# Altium schematic sheet microcontroller.SchDoc: microcontroller
size A4; Date: 05.10.2017; CheckedBy: UNCHECKED; Author: Leon Loeser; Organization: Baltic Racing; Address1: Zur Schwedenschanze 15; Address2: Haus 18; Address3: 18435 Stralsund; Revision: xx.xx; SheetNumber: 8; SheetTotal: 9; Rules: TODO; ProjectName: Projekt
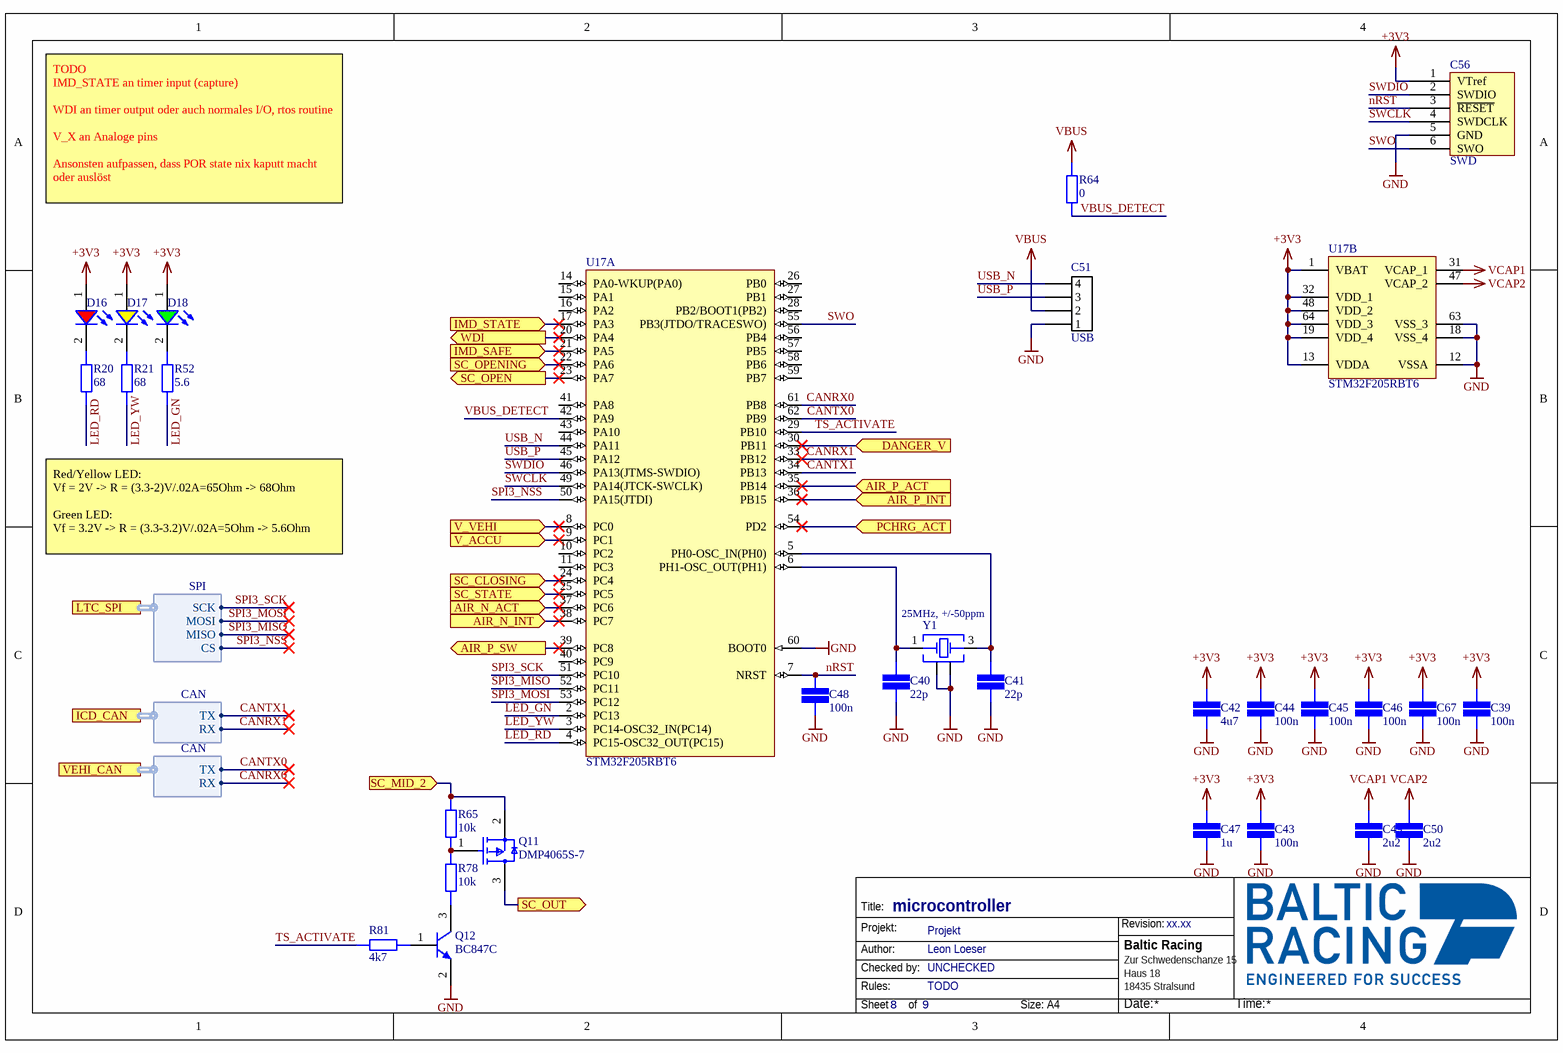
[diagram p0: microcontroller.SchDoc]

## Parts
C39  value 100n  [CAP 0603/1608]  (hidden comment: SMD Capacitor)
C40  value 22p  [CAP 0603/1608]  (hidden comment: SMD Capacitor)
C41  value 22p  [CAP 0603/1608]  (hidden comment: SMD Capacitor)
C42  value 4u7  [CAP 0805/2012]  (hidden comment: SMD Capacitor)
C43  value 100n  [CAP 0603/1608]  (hidden comment: SMD Capacitor)
C44  value 100n  [CAP 0603/1608]  (hidden comment: SMD Capacitor)
C45  value 100n  [CAP 0603/1608]  (hidden comment: SMD Capacitor)
C46  value 100n  [CAP 0603/1608]  (hidden comment: SMD Capacitor)
C47  value 1u  [CAP 0805/2012]  (hidden comment: SMD Capacitor)
C48  value 100n  [CAP 0603/1608]  (hidden comment: SMD Capacitor)
C49  value 2u2  [CAP 0805/2012]  (hidden comment: SMD Capacitor)
C50  value 2u2  [CAP 0805/2012]  (hidden comment: SMD Capacitor)
C51  USB  [43045-0412]
C56  SWD  [SEGGER_6_PIN]  (no BOM)
C67  value 100n  [CAP 0603/1608]  (hidden comment: SMD Capacitor)
D16  Red, 2 V, 140 deg  [WL-SMCW_0603_H=0.25]  (value not drawn)
D17  Yellow, 2 V, 140 deg  [WL-SMCW_0603_H=0.25]  (value not drawn)
D18  Green, 3.2 V, 140 deg  [WL-SMCW_0603_H=0.25]  (value not drawn)
Q11  DMP4065S-7  [FP-SOT23-MFG]
Q12  BC847C  [INF-SOT23_L]
R20  value 68  [STACKPOLE CSR0603]  (hidden comment: SMD Resistor)
R21  value 68  [STACKPOLE CSR0603]  (hidden comment: SMD Resistor)
R52  value 5.6  [STACKPOLE CSR0603]  (hidden comment: SMD Resistor)
R64  value 0  [STACKPOLE CSR0603]  (hidden comment: SMD Resistor)
R65  value 10k  [STACKPOLE CSR0603]  (hidden comment: SMD Resistor)
R78  value 10k  [STACKPOLE CSR0603]  (hidden comment: SMD Resistor)
R81  value 4k7  [STACKPOLE CSR0603]  (hidden comment: SMD Resistor)
U17  STM32F205RBT6  [STM-LQFP64_L]  (parts A,B of 2)
Y1  25MHz, +/-50ppm  [WE-XTAL_CFPX-180]

## Ports
AIR_N_ACT (in), AIR_N_INT (in), AIR_P_ACT (in), AIR_P_INT (in), AIR_P_SW (out), DANGER_V (in), ICD_CAN (harness CAN), IMD_SAFE (in), IMD_STATE (in), LTC_SPI (harness SPI), PCHRG_ACT (in), SC_CLOSING (in), SC_MID_2 (in), SC_OPEN (out), SC_OPENING (in), SC_OUT (out), SC_STATE (in), V_ACCU (in), V_VEHI (in), VEHI_CAN (harness CAN), WDI (out)

## Harnesses
CAN: TX, RX
SPI: SCK, MOSI, MISO, CS

## Nets
+3V3: C39.2 C42.2 C43.2 C44.2 C45.2 C46.2 C47.2 C56.1(VTref) C67.2 D16.1(A) D17.1(A) D18.1(A) U17.1(VBAT) U17.13(VDDA) U17.19(VDD_4) U17.32(VDD_1) U17.48(VDD_2) U17.64(VDD_3)
GND: C39.1 C40.1 C41.1 C42.1 C43.1 C44.1 C45.1 C46.1 C47.1 C48.1 C49.1 C50.1 C51.1 C56.5(GND) C67.1 Q12.2(E) U17.12(VSSA) U17.18(VSS_4) U17.60(BOOT0) U17.63(VSS_3) Y1.2(GND) Y1.4(GND)
VBUS: C51.2 R64.2
VCAP1: C49.2 U17.31(VCAP_1)
VCAP2: C50.2 U17.47(VCAP_2)
AIR_N_ACT: U17.37(PC6) ; port AIR_N_ACT
AIR_N_INT: U17.38(PC7) ; port AIR_N_INT
AIR_P_ACT: U17.35(PB14) ; port AIR_P_ACT
AIR_P_INT: U17.36(PB15) ; port AIR_P_INT
AIR_P_SW: U17.39(PC8) ; port AIR_P_SW
CANRX0: U17.61(PB8) ; port VEHI_CAN.RX
CANRX1: U17.33(PB12) ; port ICD_CAN.RX
CANTX0: U17.62(PB9) ; port VEHI_CAN.TX
CANTX1: U17.34(PB13) ; port ICD_CAN.TX
DANGER_V: U17.30(PB11) ; port DANGER_V
IMD_SAFE: U17.21(PA5) ; port IMD_SAFE
IMD_STATE: U17.17(PA3) ; port IMD_STATE
LED_GN: R52.1 U17.2(PC13)
LED_RD: R20.1 U17.4(PC15-OSC32_OUT(PC15))
LED_YW: R21.1 U17.3(PC14-OSC32_IN(PC14))
nRST: C48.2 C56.3(~{RESET}) U17.7(NRST)
PCHRG_ACT: U17.54(PD2) ; port PCHRG_ACT
SC_CLOSING: U17.24(PC4) ; port SC_CLOSING
SC_MID_2: Q11.2(S) R65.1 ; port SC_MID_2
SC_OPEN: U17.23(PA7) ; port SC_OPEN
SC_OPENING: U17.22(PA6) ; port SC_OPENING
SC_OUT: Q11.3(D) ; port SC_OUT
SC_STATE: U17.25(PC5) ; port SC_STATE
SPI3_MISO: U17.52(PC11) ; port LTC_SPI.MISO
SPI3_MOSI: U17.53(PC12) ; port LTC_SPI.MOSI
SPI3_NSS: U17.50(PA15(JTDI)) ; port LTC_SPI.CS
SPI3_SCK: U17.51(PC10) ; port LTC_SPI.SCK
SWCLK: C56.4(SWDCLK) U17.49(PA14(JTCK-SWCLK))
SWDIO: C56.2(SWDIO) U17.46(PA13(JTMS-SWDIO))
SWO: C56.6(SWO) U17.55(PB3(JTDO/TRACESWO))
TS_ACTIVATE: R81.2 U17.29(PB10)
USB_N: C51.4 U17.44(PA11)
USB_P: C51.3 U17.45(PA12)
V_ACCU: U17.9(PC1) ; port V_ACCU
V_VEHI: U17.8(PC0) ; port V_VEHI
VBUS_DETECT: R64.1 U17.42(PA9)
WDI: U17.20(PA4) ; port WDI
NetC40_2: C40.2 U17.6(PH1-OSC_OUT(PH1)) Y1.1(Crystal)
NetC41_2: C41.2 U17.5(PH0-OSC_IN(PH0)) Y1.3(Crystal)
NetD16_2: D16.2(K) R20.2
NetD17_2: D17.2(K) R21.2
NetD18_2: D18.2(K) R52.2
NetQ11_1: Q11.1(G) R65.2 R78.1
NetQ12_1: Q12.1(B) R81.1
NetQ12_3: Q12.3(C) R78.2

Not connected (* = marked no-connect by the designer): U17 10(PC2) 11(PC3) 14(PA0-WKUP(PA0)) 15(PA1) 16(PA2) 26(PB0) 27(PB1) 28(PB2/BOOT1(PB2)) 40(PC9) 41(PA8) 43(PA10) 56(PB4) 57(PB5) 58(PB6) 59(PB7)

## Notes on the sheet
- TODO
  IMD_STATE an timer input (capture)
  WDI an timer output oder auch normales I/O, rtos routine
  V_X an Analoge pins
  Ansonsten aufpassen, dass POR state nix kaputt macht oder auslöst
- Red/Yellow LED:
  Vf = 2V -> R = (3.3-2)V/.02A=65Ohm -> 68Ohm
  Green LED:
  Vf = 3.2V -> R = (3.3-3.2)V/.02A=5Ohm -> 5.6Ohm
- Title:
- Projekt:
- Revision:
- Author:
- Rules:
- Checked by:
- Sheet
- of
- Size:
- A4
- Date:
- Time:

## Library data of the parts
C39-C50 C67 = SMD Capacitor: Capacitor with multiple Footprints; Voltage: 6.3V
C51 = MicroFit3.0 4-Pin: Molex Micro-Fit 3.0 4-Pin / 600V / 8.5V
C56 = Segger 6-Pin
D16 = 150060RS75020: SMT Mono-color Chip LED Waterclear WL-SMCW, size 0603, Red, 2 V, 140 deg, 100 mcd; Forward Voltage: 2 V; Viewing Angle: 140 deg; Peak Wavelength: 630 nm; Dominant Wavelength: 625 nm; Luminous Intensity: 100 mcd; Chip Technology: AlInGaP; ComponentLink1Description: Manufacturer; ComponentLink1URL: http://www.we-online.de; ComponentLink2Description: Datasheet; ComponentLink2URL: https://katalog.we-online.de/led/datasheet/150060RS75020.pdf; Part Number: 150060RS75020; Published Date: November 2018; Publisher: Wurth Elektronik; Size: 0603; Operating Temperature: -40 to 85 degC; Emitting Color: Red; Mounting Technology: SMT; Packaging: Tape and Reel
D17 = 150060YS75020: SMT Mono-color Chip LED Waterclear WL-SMCW, size 0603, Yellow, 2 V, 140 deg, 130 mcd; Forward Voltage: 2 V; Viewing Angle: 140 deg; Peak Wavelength: 595 nm; Dominant Wavelength: 590 nm; Luminous Intensity: 130 mcd; Chip Technology: AlInGaP; ComponentLink1Description: Manufacturer; ComponentLink1URL: http://www.we-online.de; ComponentLink2Description: Datasheet; ComponentLink2URL: https://katalog.we-online.de/led/datasheet/150060YS75020.pdf; Part Number: 150060YS75020; Published Date: November 2018; Publisher: Wurth Elektronik; Size: 0603; Operating Temperature: -40 to 85 degC; Emitting Color: Yellow; Mounting Technology: SMT; Packaging: Tape and Reel
D18 = 150060GS75020: SMT Mono-color Chip LED Waterclear WL-SMCW, size 0603, Green, 3.2 V, 140 deg, 700 mcd; Forward Voltage: 3.2 V; Viewing Angle: 140 deg; Peak Wavelength: 515 nm; Dominant Wavelength: 525 nm; Luminous Intensity: 700 mcd; Chip Technology: InGaN; ComponentLink1Description: Manufacturer; ComponentLink1URL: http://www.we-online.de; ComponentLink2Description: Datasheet; ComponentLink2URL: https://katalog.we-online.de/led/datasheet/150060GS75020.pdf; Part Number: 150060GS75020; Published Date: November 2018; Publisher: Wurth Elektronik; Size: 0603; Operating Temperature: -40 to 85 degC; Emitting Color: Green; Mounting Technology: SMT; Packaging: Tape and Reel
Q11 = CMP-12801-000050-1: MOSFET P-CH 40V 2.4A SOT23; Manufacturer: Diodes Inc.; Number Of Channels: 1; Max Junction Temp: +150°C; Standoff Height: 0.013mm; Power Dissipation: 0.72W; Turn Off Delay Time: 36.3ns; Rthja Max: 171°C/W; Typ Forward Diode Voltage: -0.7V; Max Forward Diode Voltage: -1.2V; Drain To Source Voltage: -40V; Threshold Vgs Min: -1V; Gate To Source Voltage: 20V; Depletion Mode: False; Input Capacitace At Vds: 587pF @ -20V; Drain To Source Resistance: 64mΩ; Turn On Delay Time: 3.6ns; Continuous Drain Current: -2.4A; Pulse Drain Current: -20A; Gate Charge At Vgs: 12.2nC @ -10V; Threshold Vgs Max: -3V; Octopart: https://octopart.com/dmp4065s-7-diodes+inc.-57605044; Footprint Url: https://www.diodes.com/assets/Package-Files/SOT23.pdf; Device Class L2: Transistors; Package: SOT23; Number Of P Channels: 1; ComponentLink2URL: https://www.diodes.com/assets/Datasheets/DMP4065S.pdf; Temperature Range High: +150°C; Device Class L1: Discrete Semiconductors; Temperature Range Low: -55°C; Manufacturer Part Number: DMP4065S-7; ComponentLink2Description: Datasheet; Lead Free: Yes; Temperature: -55°C to +150°C; Drain To Source Breakdown Voltage: -40V; Category: Trans; Height: 1.1mm; Digikey Description: MOSFET P-CH 40V 2.4A SOT23; Ipc Land Pattern Name: SOT92P240X102-3; Device Class L3: MOSFETs; RoHS: TRUE; Mouser Description: Trans MOSFET P-CH 40V 2.4A Automotive 3-Pin SOT-23 T/R; Automotive: No
Q12 = CMP-1177-00037-1: NPN Silicon AF Transistor, 45 V VCEO, 100 mA IC, SOT23, Reel, Green; Manufacturer: Infineon; VCEO (max): 45Â V; VEBO (max): 6Â V; fT (typ): 250Â MHz; VCBO (max): 50Â V; ICM (max): 200Â mA; Green: TRUE; IC (max): 100Â mA; Ptot (max): 330Â mW; ICBO (max): 15Â nA; PartNumber: BC847C; ComponentLink3URL: http://www.infineon.com/dgdl/SOT23-Package_Overview.pdf?folderId=db3a30431936bc4b0119532290053c66&fileId=db3a30431936bc4b0119533468123c85; ComponentLink3Description: Package Specification; Mounting Technology: Surface Mount; PackageDescription: 3-Pin Small Outline Transistor Package, 1.3 x 2.9 mm Body, 0.95 mm Pitch; PackageReference: SOT23; ComponentLink2URL: http://www.infineon.com/dgdl/bc847series_bc848series_bc849series_bc850series.pdf?folderId=db3a304314dca389011541d30fa21656&fileId=db3a304314dca389011541d4630a1657; ComponentLink2Description: Datasheet; ComponentLink1Description: Manufacturer URL; Polarity: NPN; ComponentLink1URL: http://www.infineon.com/; IBM (max): 200Â mA; Packing: Reel; PackageVersion: Apr-08
R20 R21 R52 R64 R65 R78 R81 = SMD Resistor: Resistor with multiple footprints
U17 = CMP-0237-00091-3: ARM Cortex-M3 32-bit MCU, 128 KB Flash, 64 KB Internal RAM, 51 I/Os, 64-pin LQFP, -40 to 85 degC, Tray; Supply Voltage(Vcc) min (V): 1.8; D/A Converter: 2x12-bit (2 Channel); I/Os (High Current): 51; Internal RAM Size (kB): 64; FLASH Size (Prog) (kB): 128; Operating Frequency(F) (Processor speed) (MHz): 120; ComponentLink1Description: Manufacturer URL; DatasheetVersion: Rev. 9; PartNumber: STM32F205RBT6; ComponentLink1URL: http://www.st.com/web/en/home.html; Core: ARM Cortex-M3; ComponentLink3Description: Package Specification; Packing: Tray; PackageReference: LQFP64; Mounting Technology: Surface Mount; ComponentLink2Description: Datasheet; PackageVersion: Rev. 4, 06/2013; PackageDescription: 64-Pin Low Profile Quad Flat Package, 10 x 10 mm Body, 0.5 mm Pitch; ComponentLink2URL: http://www.st.com/st-web-ui/static/active/en/resource/technical/document/datasheet/CD00237391.pdf; ComponentLink3URL: http://www.st.com/st-web-ui/static/active/en/resource/technical/document/datasheet/DM00037051.pdf
Y1 = 830035268: WE-XTAL Quartz Crystal, SMT, CFPX-180, 25MHz, +/-50ppm; Load Capacitance: 16pF; ComponentLink1Description: Manufacturer; ComponentLink1URL: http://www.we-online.de; ComponentLink2Description: Datasheet; ComponentLink2URL: https://katalog.we-online.com/pbs/datasheet/830035268.pdf; Operating Temperature: -10 to +60degC; Packaging: Tape and Reel; Part Number: 830035268; Published Date: November 2019; Size: CFPX-180; Frequency Stability: +/-50ppm; Frequency: 25MHz; Frequency Tolerance: +/-50ppm; Mounting Technology: SMT; Publisher: Wurth Elektronik